# EAGLE design MS-PS3 (EAGLE 6.2)
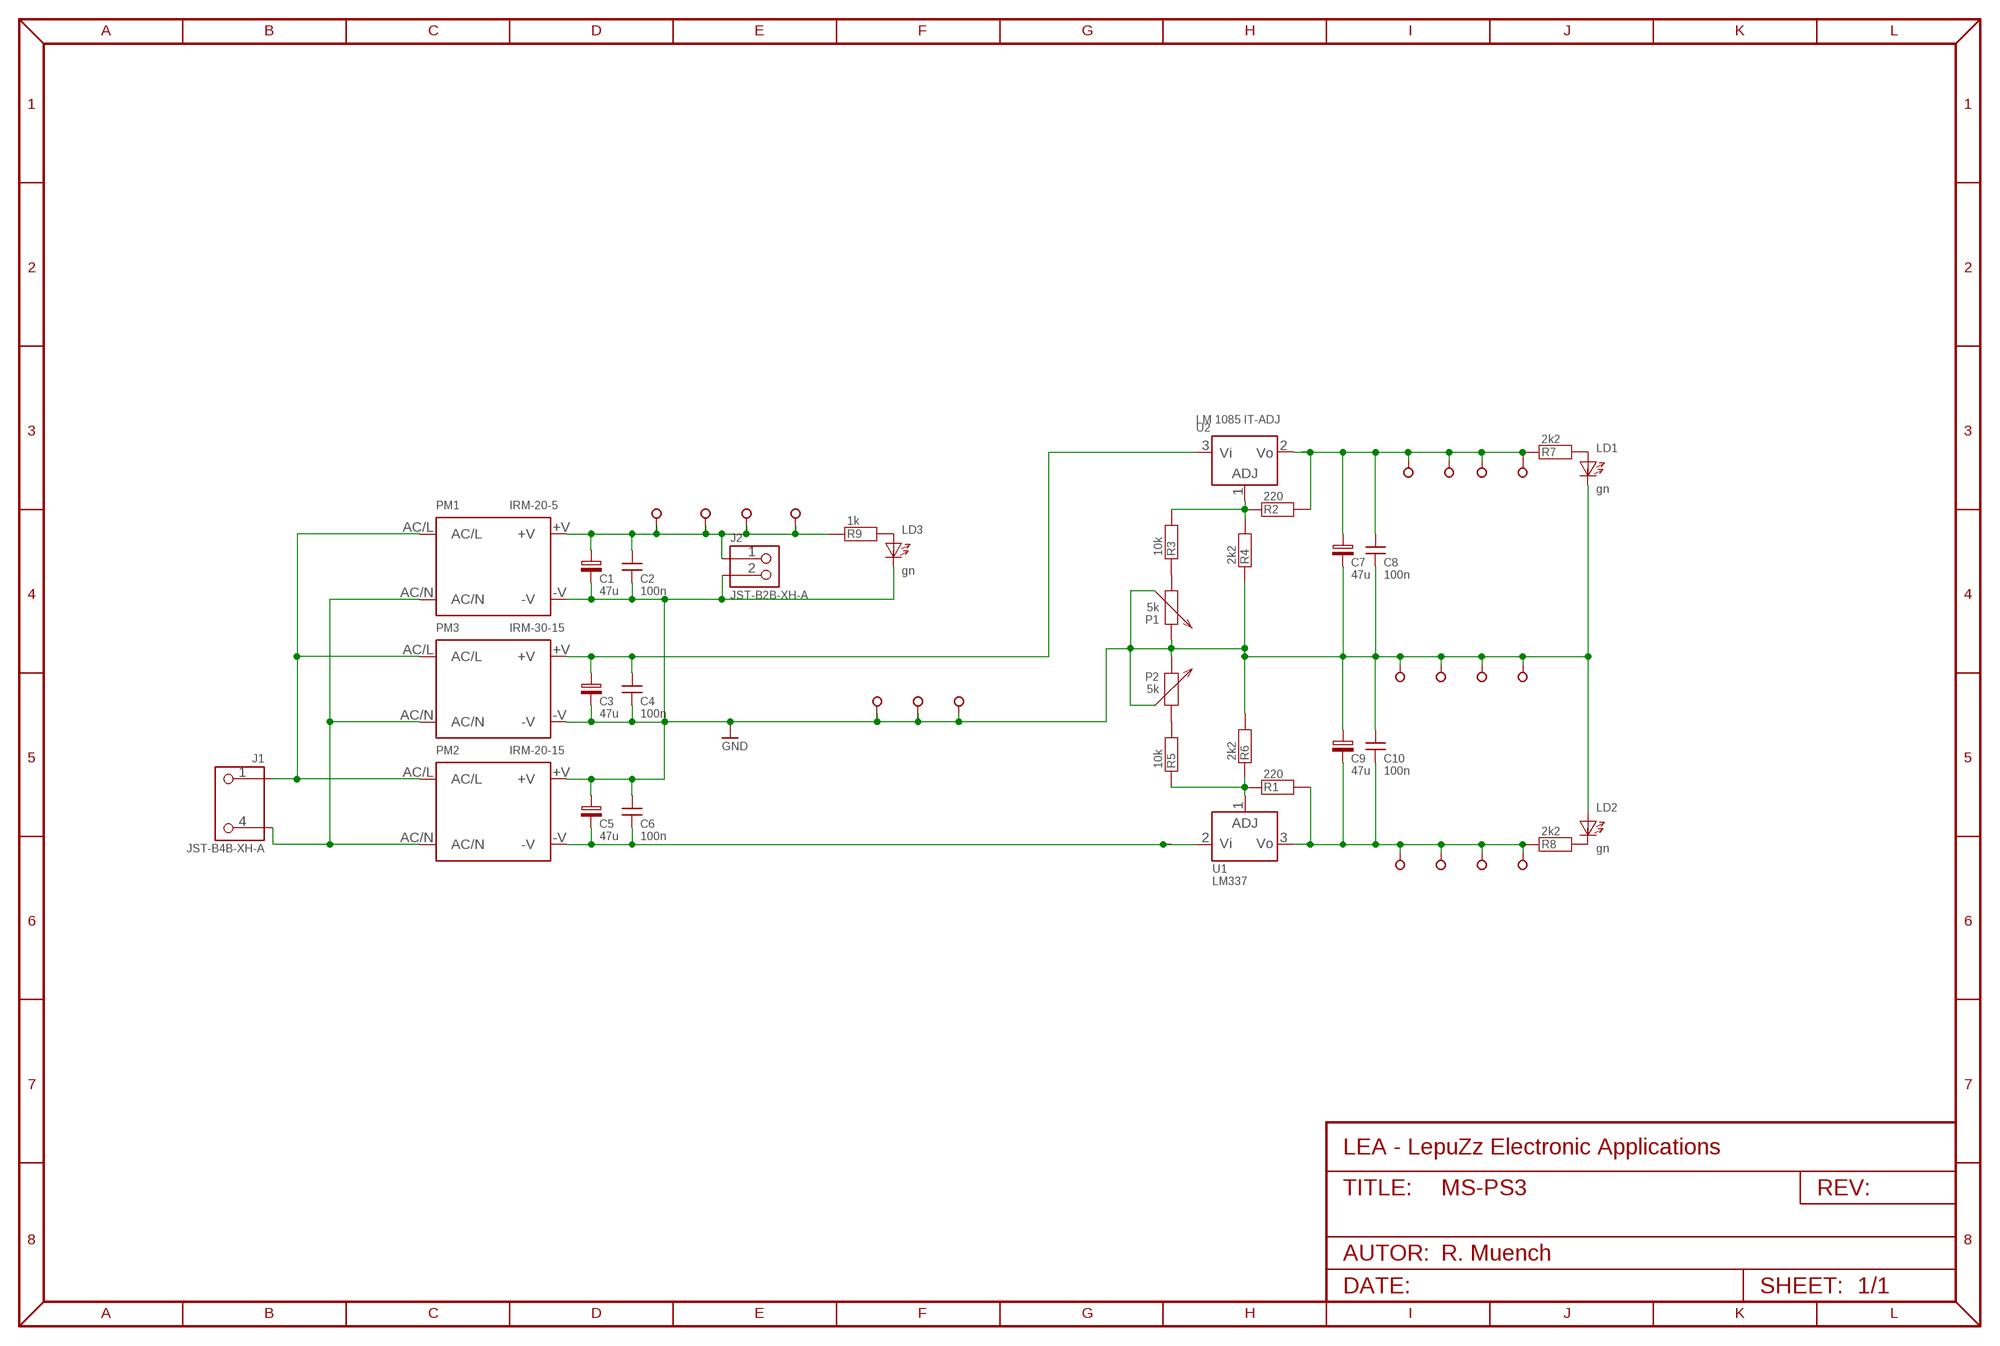
[diagram p0: schematic, sheet 1]

## Parts
C1  47u  C-ELKO_2,5X6,3_R  [ES2,5X6,3]
C2  100n  C_K_5X2.5  [K5-2,5]
C3  47u  C-ELKO_2,5X6,3_R  [ES2,5X6,3]
C4  100n  C_K_5X2.5  [K5-2,5]
C5  47u  C-ELKO_2,5X6,3_R  [ES2,5X6,3]
C6  100n  C_K_5X2.5  [K5-2,5]
C7  47u  C-ELKO_2,5X6,3_R  [ES2,5X6,3]
C8  100n  C_K_5X2.5  [K5-2,5]
C9  47u  C-ELKO_2,5X6,3_R  [ES2,5X6,3]
C10  100n  C_K_5X2.5  [K5-2,5]
J1  JST-B4B-XH-A  CON04  [JST-B4B-XH-A-HV]
J2  JST-B2B-XH-A  CON02XH-B2B  [JST-B2B-XH-A]
J3  FLACHSTECKER-6,35  [FLACHSTECKER-6,35]
J4  FLACHSTECKER-6,35  [FLACHSTECKER-6,35]
J5  FLACHSTECKER-6,35  [FLACHSTECKER-6,35]
J6  FLACHSTECKER-6,35  [FLACHSTECKER-6,35]
J7  FLACHSTECKER-6,35  [FLACHSTECKER-6,35]
J8  FLACHSTECKER-6,35  [FLACHSTECKER-6,35]
J9  FLACHSTECKER-6,35  [FLACHSTECKER-6,35]
J10  FLACHSTECKER-6,35  [FLACHSTECKER-6,35]
J11  FLACHSTECKER-6,35  [FLACHSTECKER-6,35]
J12  FLACHSTECKER-6,35  [FLACHSTECKER-6,35]
J13  FLACHSTECKER-6,35  [FLACHSTECKER-6,35]
J14  FLACHSTECKER-6,35  [FLACHSTECKER-6,35]
J15  FLACHSTECKER-6,35  [FLACHSTECKER-6,35]
J16  FLACHSTECKER-6,35  [FLACHSTECKER-6,35]
J17  FLACHSTECKER-6,35  [FLACHSTECKER-6,35]
J18  FLACHSTECKER-6,35  [FLACHSTECKER-6,35]
J19  FLACHSTECKER-6,35  [FLACHSTECKER-6,35]
J20  FLACHSTECKER-6,35  [FLACHSTECKER-6,35]
J21  FLACHSTECKER-6,35  [FLACHSTECKER-6,35]
LD1  gn  LED3MM  [LED3]
LD2  gn  LED3MM  [LED3]
LD3  gn  LED3MM  [LED3]
P1  5k  R-TRIM64Y  [POT-25-64Y]
P2  5k  R-TRIM64Y  [POT-25-64Y]
PM1  IRM-20-5  IRM-XX20WATT  [IRM-20]
PM2  IRM-20-15  IRM-XX20WATT  [IRM-20]
PM3  IRM-30-15  IRM-XX30WATT  [IRM-30]
R1  220  R_7.5_250  [R-7,5]
R2  220  R_7.5_250  [R-7,5]
R3  10k  R_7.5_250  [R-7,5]
R4  2k2  R_7.5_250  [R-7,5]
R5  10k  R_7.5_250  [R-7,5]
R6  2k2  R_7.5_250  [R-7,5]
R7  2k2  R_7.5_250  [R-7,5]
R8  2k2  R_7.5_250  [R-7,5]
R9  1k  R_7.5_250  [R-7,5]
U1  LM337  337TA  [TO-220N]
U2  LM 1085 IT-ADJ  317TN  [TO-220N]
U$5  SK65  [SK65-37,5]
U$7  SK65  [SK65-37,5]

## Nets
+12V: C7.1 C8.1 J9.P$1 J9.P$2 J10.P$1 J10.P$2 J11.P$1 J11.P$2 J12.P$1 R2.2 R7.1 U2.2(VO) U$7.P$1 U$7.P$2
-15V: C5.2 C6.2 PM2.-V U1.2(VI) U$5.P$1 U$5.P$2
GND: C1.2 C2.2 C3.2 C4.2 C5.1 C6.1 C7.2 C8.2 C9.1 C10.1 J2.2 J7.P$1 J7.P$2 J8.P$1 J8.P$2 J13.P$1 J13.P$2 J14.P$1 J14.P$2 J15.P$1 J15.P$2 J16.P$1 J16.P$2 J21.P$1 J21.P$2 LD1.K LD2.A LD3.K P1.2 P1.3 P2.2 P2.3 PM1.-V PM2.+V PM3.-V R4.1 R6.2
N$1: J1.4 PM1.AC/N PM2.AC/N PM3.AC/N
N$2: J1.1 PM1.AC/L PM2.AC/L PM3.AC/L
N$3: R1.1 R5.1 R6.1 U1.1(ADJ)
N$4: R2.1 R3.2 R4.2 U2.1(ADJ)
N$5: LD1.A R7.2
N$6: LD2.K R8.2
N$8: P2.1 R5.2
N$10: C3.1 C4.1 PM3.+V U2.3(VI)
N$11: P1.1 R3.1
N$12: LD3.A R9.2
N$27: C9.2 C10.2 J17.P$1 J17.P$2 J18.P$1 J18.P$2 J19.P$1 J19.P$2 J20.P$1 J20.P$2 R1.2 R8.1 U1.3(VO)
N$43: C1.1 C2.1 J2.1 J3.P$1 J3.P$2 J4.P$1 J4.P$2 J5.P$1 J5.P$2 J6.P$1 J6.P$2 PM1.+V R9.1
Unconnected: J12.P$2

## Library data of the parts
C1 C3 C5 C7 C9 = passiv:C-ELKO: Elektrolyt Kondensator
C2 C4 C6 C8 C10 = passiv:C: ungepolter Kondensator
J1 = synth:CON04
J2 = PLUG:CON02: Steckverbinder 2polig; ARTNUM: XXX-XXX
J3-J21 = synth:FLACHSTECKER-6,35
LD1-LD3 = OPTO:LED; ARTNUM: XXX-XXX
P1 P2 = passiv:R-TRIM: Widerstandstrimmer
PM1-PM3 = synth:IRM-XX
R1-R9 = passiv:R: Widerstand; ARTNUM: XXX-XXX
U1 = LINEAR:337T
U2 = LINEAR:317T; ARTNUM: 110-008
U$5 U$7 = synth:SK65

## Board
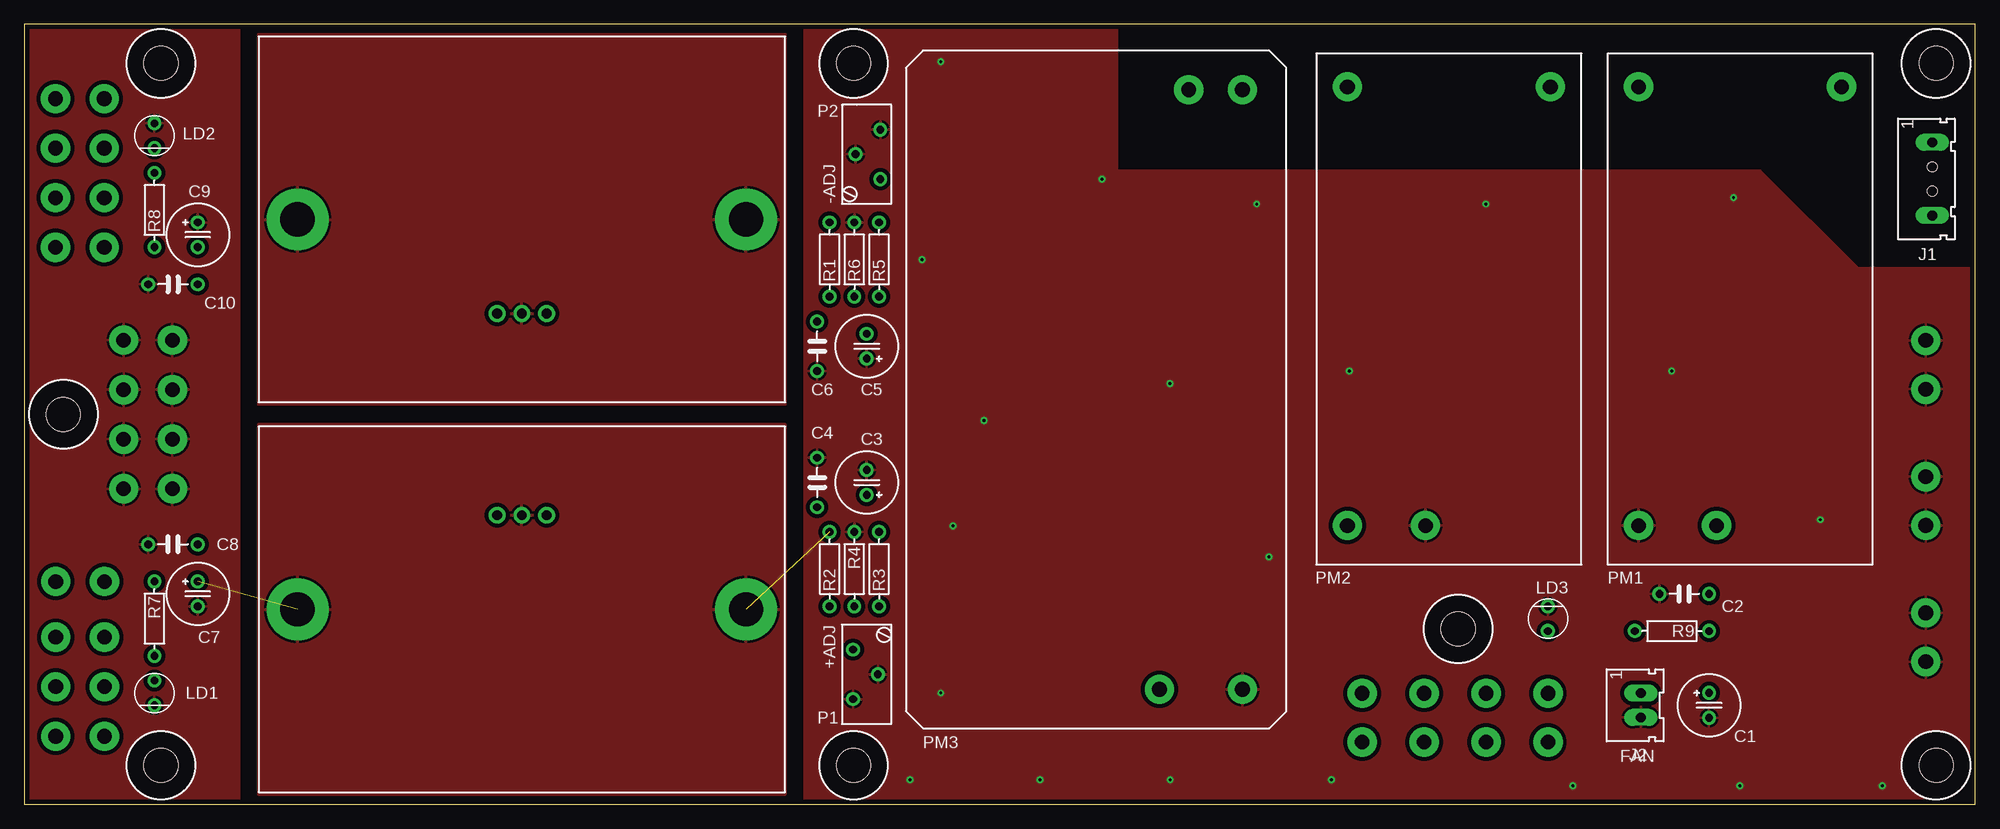
[diagram p1: board, top side]
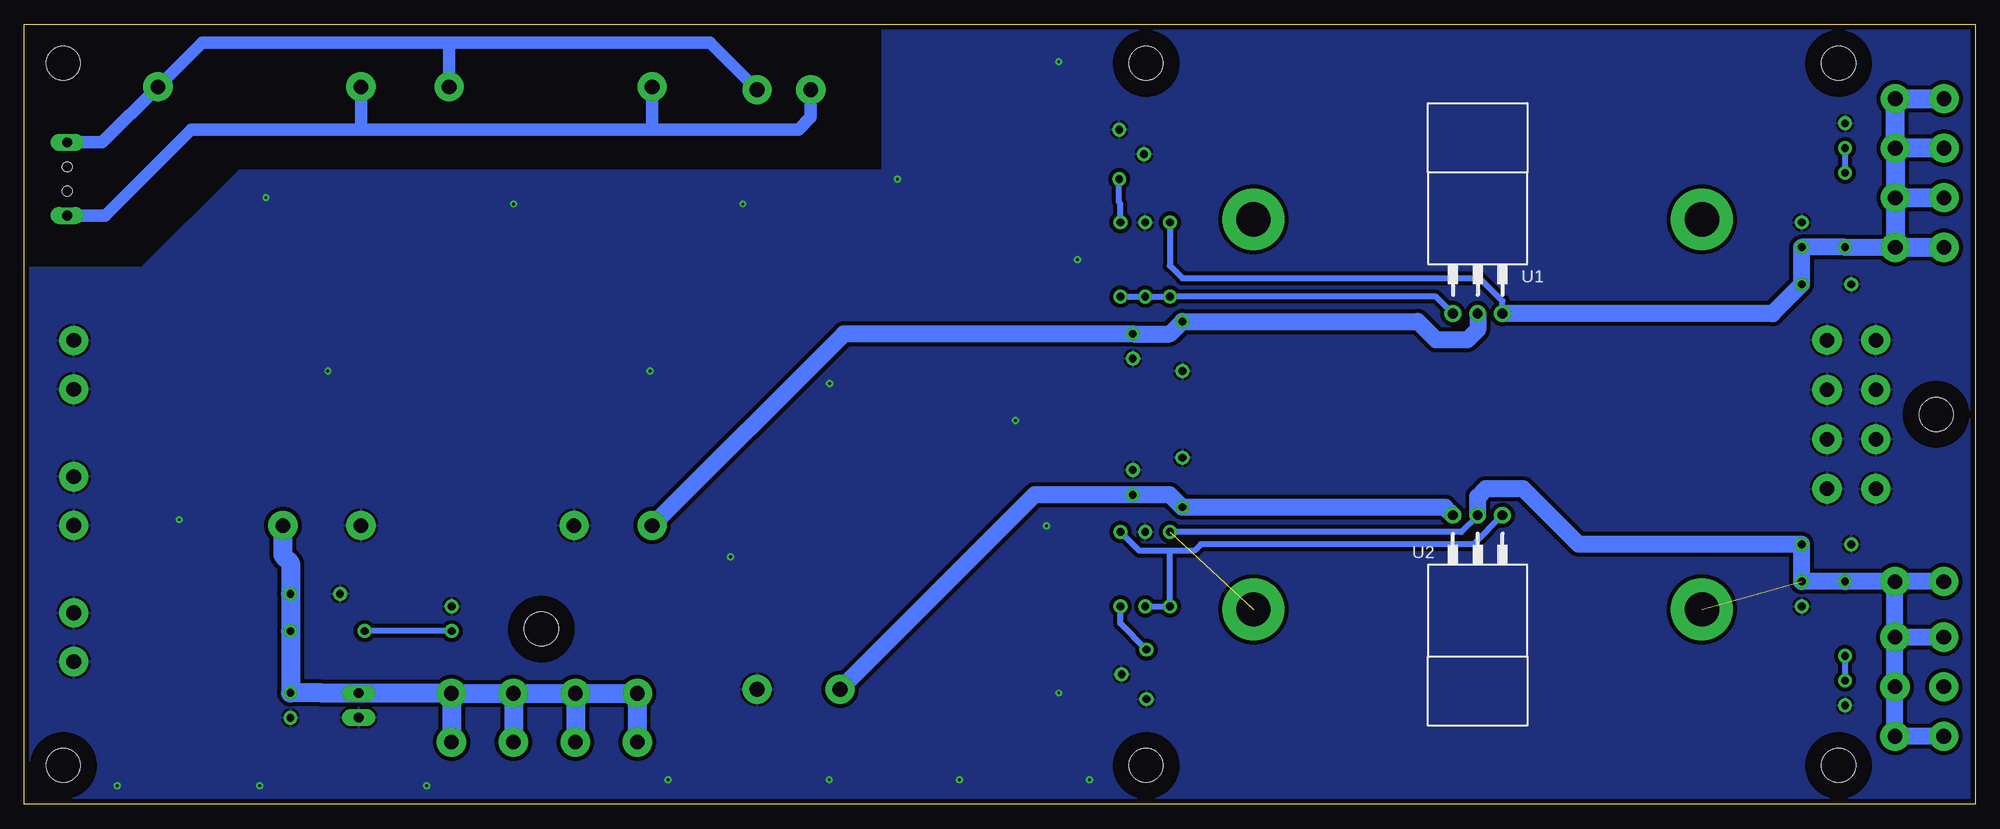
[diagram p2: board, bottom side, seen from below]

Size 200 x 80 mm. Coordinates in mm from the lower left corner, seen from the top.
Outline: 200,80 0,80 0,0 200,0 200,80
Copper layers (1*16): Top 0.035mm / dielectric 1.5mm / Bottom 0.035mm
Design rules: minimum track width 10mil, minimum drill 22mil, track to track 8mil, track to pad 8mil, pad to pad 8mil, via to via 8mil, smd to smd 8mil, copper to edge 20mil, drill to drill 8mil, minimum pad ring 10mil, minimum via ring 8mil, stop-mask expansion 4mil, vias tented up to drill 0mil, thermal gap 10mil
Milling: 4 lines

### Footprints (pad centres in the part's own frame; a part is rotated, then mirrored left to right if it is on the bottom)
ES2,5X6,3 = drill 0.8 pad 1.422: 1 -1.27,0; 2 1.27,0
K5-2,5 = drill 0.8 pad 1.422: 1 -2.54,0; 2 2.54,0
JST-B4B-XH-A-HV = drill 1 pad 1.727 long: 1 3.75,0; 4 -3.75,0 | hole 1: -1.25,0; 1.25,0
JST-B2B-XH-A = drill 1 pad 1.727 long: 1 1.25,0; 2 -1.25,0
FLACHSTECKER-6,35 = drill 1.5 pad 3: P$1 0,2.5; P$2 0,-2.5
LED3 = drill 0.8 pad 1.422: A 1.27,0; K -1.27,0
POT-25-64Y = drill 0.8 pad 1.422: 1 -2.54,-1.397; 2 0,1.143; 3 2.54,-1.397
IRM-20 = drill 1.5 pad 3: +V 22.2,-2.4; -V 22.2,-10.4; AC/L -22.8,10.4; AC/N -22.8,-10.4
IRM-30 = drill 1.5 pad 3: +V -30.75,-6.5; -V -30.75,-15; AC/L 30.75,-15; AC/N 30.75,-9.5
R-7,5 = drill 0.8 pad 1.422: 1 -3.81,0; 2 3.81,0
TO-220N = drill 1 pad 1.727: 1 -2.54,-18.415; 2 0,-18.415; 3 2.54,-18.415
BF3,5 = hole 3.5: 0,0
SK65-37,5 = drill 3.5 pad 6.35: P$1 23,0; P$2 -23,0

### Placement (x,y rotation side)
C1  172.72,10.16 270 top
C2  170.18,21.59 180 top
C3  86.36,33.02 90 top
C4  81.28,33.02 90 top
C5  86.36,46.99 90 top
C6  81.28,46.99 90 top
C7  17.78,21.59 270 top
C8  15.24,26.67 180 top
C9  17.78,58.42 270 top
C10  15.24,53.34 0 top
J1  195.6,64.14 90 top
J2  165.74,10.16 90 top
J3  156.21,8.89 180 top
J4  149.86,8.89 180 top
J5  143.51,8.89 180 top
J6  137.16,8.89 180 top
J7  194.94,17.14 180 top
J8  194.94,45.09 180 top
J9  5.71,22.86 270 top
J10  5.71,17.14 270 top
J11  5.71,6.99 270 top
J12  5.71,12.06 270 top
J13  12.68,32.38 270 top
J14  12.68,37.45 270 top
J15  12.68,42.53 270 top
J16  12.68,47.62 270 top
J17  5.69,72.38 270 top
J18  5.69,57.14 270 top
J19  5.69,67.3 270 top
J20  5.69,62.22 270 top
J21  194.94,31.11 180 top
LD1  13.34,11.43 90 top
LD2  13.34,68.58 90 top
LD3  156.21,19.05 270 top
P1  86.36,13.34 270 top
P2  86.36,66.67 90 top
PM1  175.9,50.8 270 top
PM2  146.05,50.8 270 top
PM3  109.88,42.55 90 top
R1  82.55,55.88 90 top
R2  82.55,24.13 90 top
R3  87.63,24.13 90 top
R4  85.09,24.13 270 top
R5  87.63,55.88 90 top
R6  85.09,55.88 90 top
R7  13.34,19.05 270 top
R8  13.34,60.96 90 top
R9  168.91,17.78 180 top
U1  51,68.75 0 bottom
U2  51,11.25 180 bottom
U$1  [BF3,5]  85,4 180 top
U$5  51,60 180 top
U$7  51,20 0 top
U$25  [LEA-MASK]  179.07,15.24 0 top
U$31  [BF3,5]  4,40 180 top
U$32  [BF3,5]  14,4 180 top
U$33  [BF3,5]  14,76 180 top
U$34  [BF3,5]  85,76 180 top
U$35  [BF3,5]  147,18 180 top
U$36  [BF3,5]  196,76 180 top
U$37  [BF3,5]  196,4 180 top

### Tracks (layer width: path | path; a pad name or v marks a point on that pad's centre or on a via)
+12V  (2 unrouted)
  Bottom 0.635: U2.2 51,29.64 52.7,27.94 R2.2
  Bottom 1.727: J10.P$1 J12.P$1 J11.P$1 J11.P$2 | J10.P$1 J9.P$1 | J9.P$2 J9.P$1 | J10.P$2 J10.P$1 | J9.P$1 R7.1 C7.1 C8.1 40.64,26.67 46.35,32.38 50.16,32.38 51,31.55 U2.2
  pour Top (isolate 0.406): 78,1 24,1 24,39 78,39
-15V
  Bottom 1.727: PM2.-V 115.99,48.26 C5.2 82.55,48.26 C6.2 57.15,49.53 55.24,47.62 52.07,47.62 51,48.7 U1.2
  pour Top (isolate 0.406): 78,41 24,41 24,79 78,79
GND  (via drill 0.3 pad 0.51)
  other vias: 184.12,29.2 149.84,61.59 127.61,25.39 117.47,2.54 175.9,1.91 158.75,1.91 190.5,1.91 98.4,39.36 110.47,64.12 92.05,55.87 135.87,44.44 133.99,2.54 168.88,44.44 175.24,62.22 126.34,61.59 93.95,76.19 93.95,11.42 90.81,2.54 104.14,2.54 117.45,43.17 95.22,28.57
  pour Bottom (isolate 0.406): 200,55 188,55 188,55 178,65 112,65 112,80 0,80 0,0 200.03,0 200.03,15.24 200,26
  pour Top (isolate 0.406): 200,55 188,55 178,65 112,65 112,80 80,80 80,0 200.03,0 200.03,16.51 200,26
  pour Top (isolate 0.406): 22,80 0,80 0,0 22,0
N$1
  Bottom 1.27: PM1.AC/N 165.5,69.22 | PM2.AC/N 135.65,69.22 | 135.65,69.22 165.5,69.22 | PM3.AC/N 119.38,70.48 120.65,69.22 135.65,69.22 | 165.5,69.22 182.88,69.22 191.7,60.4 J1.4
N$2
  Bottom 1.27: J1.1 192,67.89 PM1.AC/L 181.79,78.11 156.45,78.11 | PM2.AC/L 156.45,78.11 | PM3.AC/L 129.68,78.11 156.45,78.11
N$3
  Bottom 0.635: R5.1 R6.1 R1.1 55.27,52.07 U1.1
N$4
  Bottom 0.635: U2.1 51.45,26.67 79.38,26.67 80.01,26.04 82.55,26.04 | R3.2 85.72,26.04 82.55,26.04 | 82.55,26.04 R2.1 R4.2
N$5
  Bottom 0.635: LD1.A R7.2
N$6
  Bottom 0.635: R8.2 LD2.K
N$8
  Bottom 0.635: R5.2 87.63,61.59 87.76,61.72 P2.1
N$10
  Bottom 1.727: U2.3 54.35,30.48 C4.1 82.55,31.75 C3.1 96.44,31.75 PM3.+V
N$11
  Bottom 0.635: P1.1 87.63,18.54 R3.1
N$12
  Bottom 0.635: LD3.A R9.2
N$27
  Bottom 0.635: R1.2 82.55,55.24 81.28,53.98 50.8,53.98 48.46,51.63 U1.3
  Bottom 1.727: U1.3 20.79,50.34 C10.2 C9.2 R8.1 J18.P$1
  Bottom 1.93: J19.P$1 J17.P$1 J17.P$2 | J19.P$1 J20.P$1 | J19.P$2 J19.P$1 | J20.P$1 J18.P$1 J18.P$2 | J20.P$1 J20.P$2
N$43
  Bottom 1.93: PM1.+V 173.5,25.54 172.72,24.77 C2.1 R9.1 C1.1 169.54,11.43 169.53,11.41 J2.1 156.21,11.41 J3.P$2 | J3.P$2 J4.P$2 | J4.P$2 J5.P$2 | J5.P$2 J6.P$2 J6.P$1 | J5.P$2 J5.P$1 | J4.P$2 J4.P$1 | J3.P$2 J3.P$1

### Text on the board
tPlace: -ADJ | +ADJ | FAN
tStop: -12V | GND | GND | GND | GND | MSPS-3 | R0 | +12V | +5V | 1220